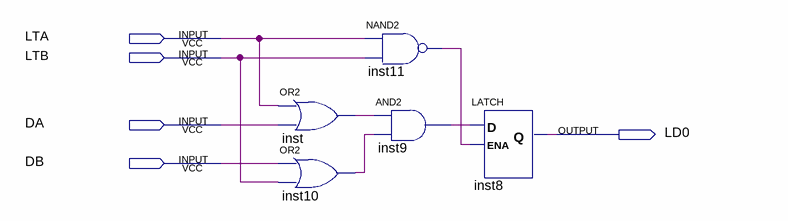
[diagram p0: schematic sheet]
// Quartus schematic 2buferlatch1b.bdf as structural Verilog: 5 symbols, 5 pins
module \2buferlatch1b  (
  input  LTA,
  input  LTB,
  input  DA,
  input  DB,
  output LD0
);

  wire inst9_out, inst10_out, inst11_out, inst_out;

  or inst (inst_out, LTA, DA);
  or inst10 (inst10_out, DB, LTB);
  nand inst11 (inst11_out, LTA, LTB);
  and inst9 (inst9_out, inst_out, inst10_out);
  LATCH inst8 (.D(inst9_out), .ENA(inst11_out), .Q(LD0));
endmodule
